# EAGLE design unitygain (EAGLE 7.7.0)
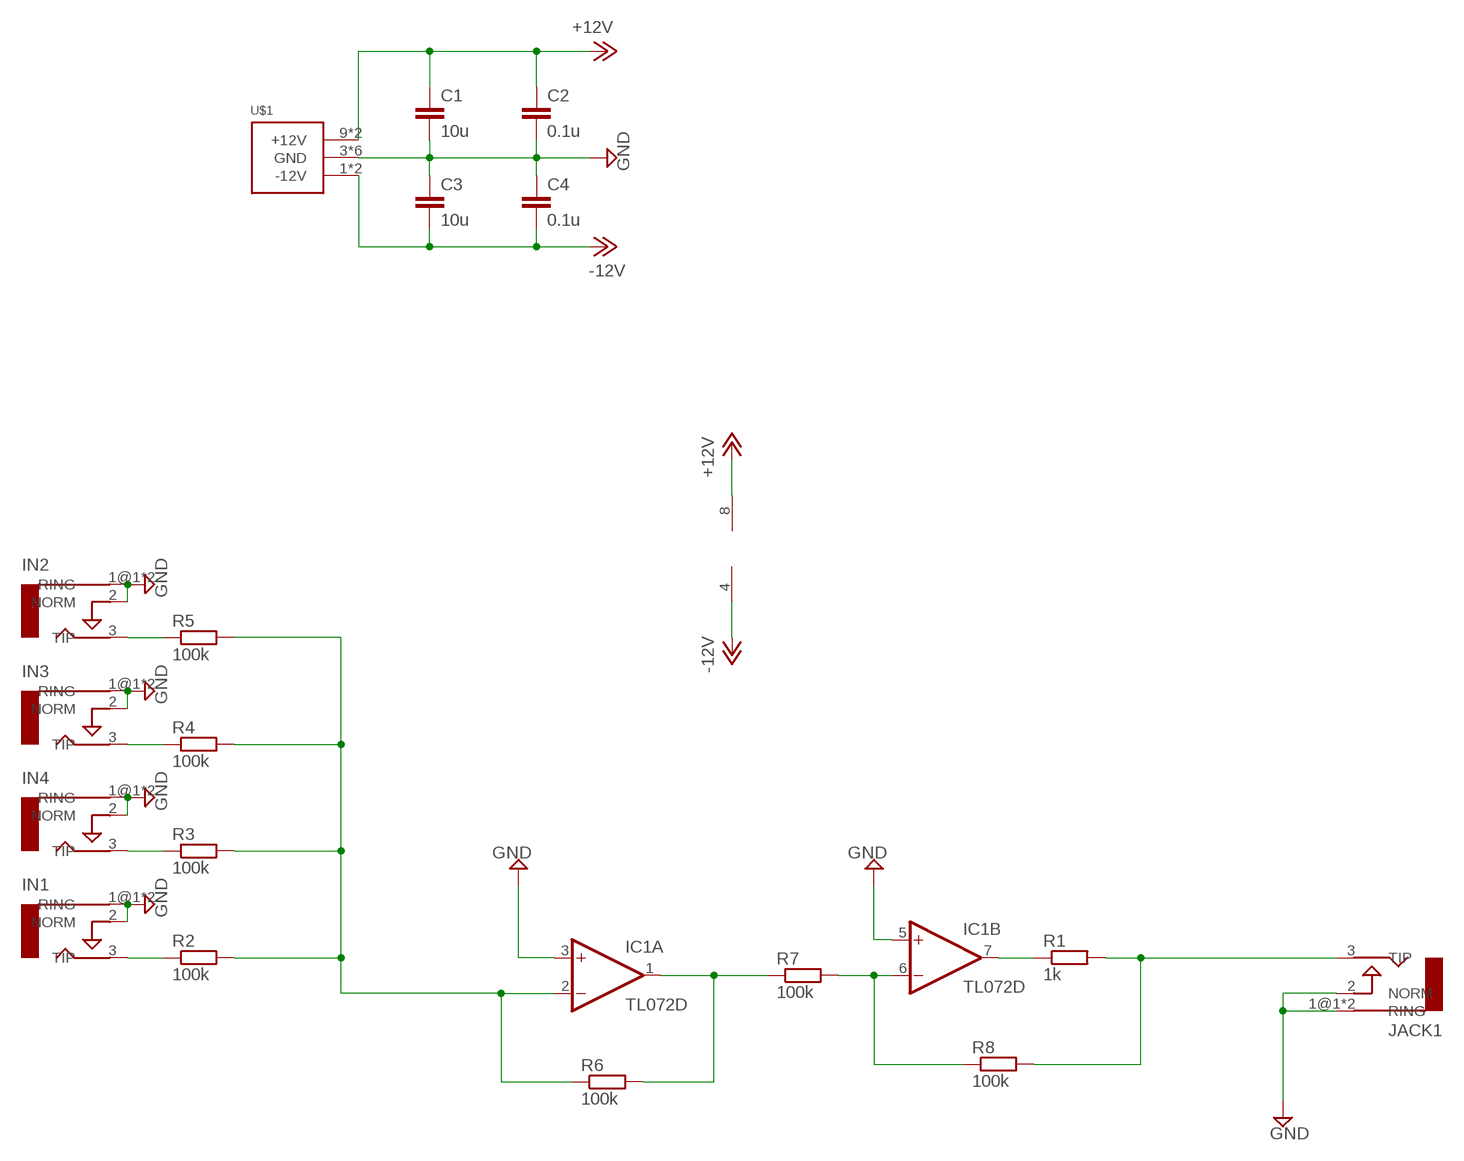
[diagram p0: schematic, sheet 1]

## Parts
C1  10u  C-EUC0805  [C0805]
C2  0.1u  C-EUC0805  [C0805]
C3  10u  C-EUC0805  [C0805]
C4  0.1u  C-EUC0805  [C0805]
IC1  TL072D  [SO08]
IN1  IN1  AUDIO-JACKERTHENVAR  [ERTHENVAR-JACK]
IN2  IN2  AUDIO-JACKERTHENVAR  [ERTHENVAR-JACK]
IN3  IN3  AUDIO-JACKERTHENVAR  [ERTHENVAR-JACK]
IN4  IN4  AUDIO-JACKERTHENVAR  [ERTHENVAR-JACK]
JACK1  OUT  AUDIO-JACKERTHENVAR  [ERTHENVAR-JACK]
R1  1k  R-EU_R0805  [R0805]
R2  100k  R-EU_R0805  [R0805]
R3  100k  R-EU_R0805  [R0805]
R4  100k  R-EU_R0805  [R0805]
R5  100k  R-EU_R0805  [R0805]
R6  100k  R-EU_R0805  [R0805]
R7  100k  R-EU_R0805  [R0805]
R8  100k  R-EU_R0805  [R0805]
U$1  POWER_SIMPLE10  [POWER_10]

## Nets
+12V: C1.1 C2.1 IC1.8(P:V+) U$1.9(+12V) U$1.10(+12V)
-12V: C3.2 C4.2 IC1.4(P:V-) U$1.1(-12V) U$1.2(-12V)
GND: C1.2 C2.2 C3.1 C4.1 IC1.3(A:+IN) IC1.5(B:+IN) IN1.1@1(RING) IN1.1@2(RING) IN1.2(NORM) IN2.1@1(RING) IN2.1@2(RING) IN2.2(NORM) IN3.1@1(RING) IN3.1@2(RING) IN3.2(NORM) IN4.1@1(RING) IN4.1@2(RING) IN4.2(NORM) JACK1.1@1(RING) JACK1.1@2(RING) JACK1.2(NORM) U$1.3(GND) U$1.4(GND) U$1.5(GND) U$1.6(GND) U$1.7(GND) U$1.8(GND)
N$1: JACK1.3(TIP) R1.2 R8.2
N$2: IC1.7(B:OUT) R1.1
N$3: IN1.3(TIP) R2.1
N$4: IC1.6(B:-IN) R7.2 R8.1
N$5: IC1.2(A:-IN) R2.2 R3.2 R4.2 R5.2 R6.1
N$7: IN4.3(TIP) R3.1
N$8: IN3.3(TIP) R4.1
N$9: IN2.3(TIP) R5.1
N$15: IC1.1(A:OUT) R6.2 R7.1

## Library data of the parts
C1-C4 = rcl:C-EU: CAPACITOR, European symbol
IC1 = linear:TL072: OP AMP
IN1-IN4 JACK1 = erthenvar:AUDIO-JACK: Switching Mono 3.5mm Audio Jack from Erthenvar.
R1-R8 = rcl:R-EU_: RESISTOR, European symbol
U$1 = eurorack:POWER_SIMPLE

## Board
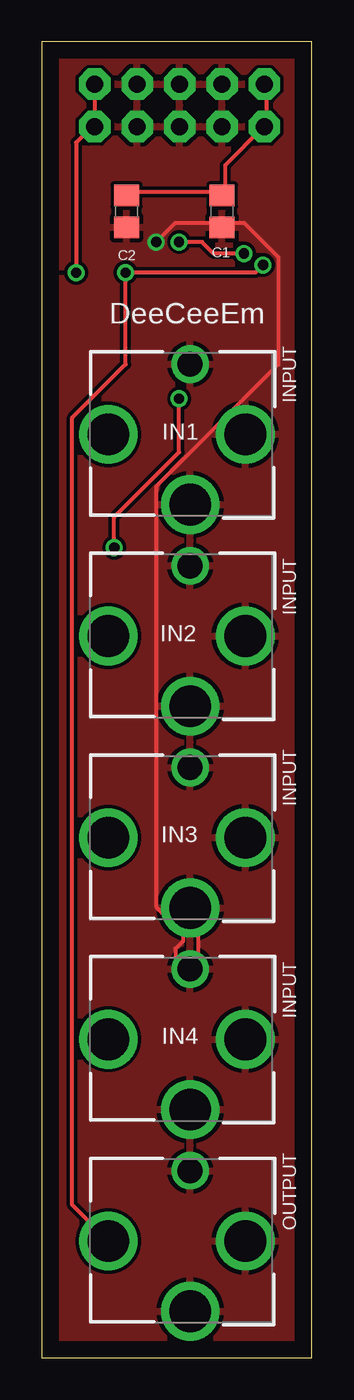
[diagram p1: board, top side]
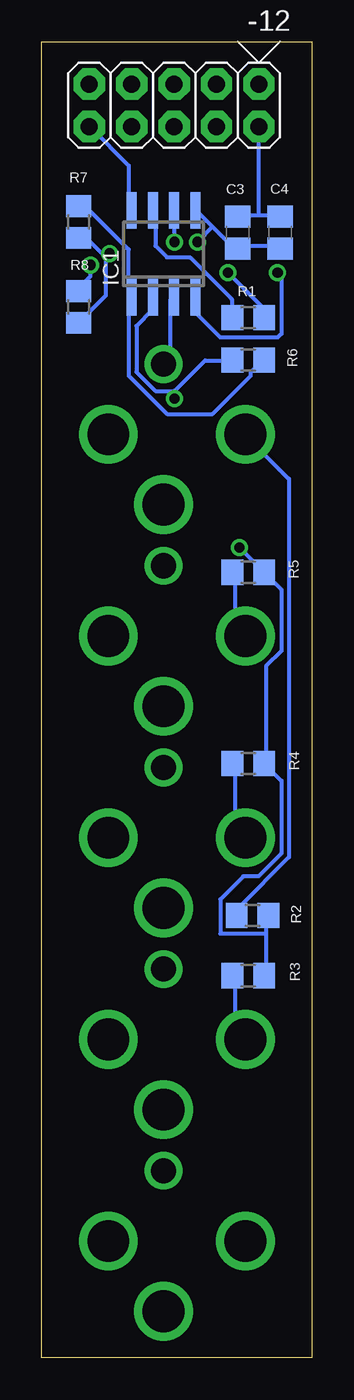
[diagram p2: board, bottom side, seen from below]

Size 16.18 x 78.73 mm. Coordinates in mm from the lower left corner, seen from the top.
Outline: 0,0 16.18,0 16.18,78.73 0,78.73 0,0
Copper layers (1*16): Top 0.035mm / dielectric 1.5mm / Bottom 0.035mm
Design rules "default": minimum track width 10mil, minimum drill 24mil, track to track 8mil, track to pad 8mil, pad to pad 8mil, via to via 8mil, smd to smd 8mil, copper to edge 40mil, drill to drill 8mil, minimum pad ring 10mil, minimum via ring 8mil, stop-mask expansion 4mil, vias tented up to drill 0mil, thermal gap 10mil

### Footprints (pad centres in the part's own frame; a part is rotated, then mirrored left to right if it is on the bottom)
C0805 = smd 1.3 x 1.5: 1 -0.95,0; 2 0.95,0
SO08 = smd 0.6 x 2.2: 1 -1.905,-2.6; 2 -0.635,-2.6; 3 0.635,-2.6; 4 1.905,-2.6; 5 1.905,2.6; 6 0.635,2.6; 7 -0.635,2.6; 8 -1.905,2.6
ERTHENVAR-JACK = drill 2.5: 1@1 -4.2,0; 2 0,-3.3; 3 0,4.9 | drill 1.5: 1@2 4.2,0
R0805 = smd 1.3 x 1.5: 1 -0.95,0; 2 0.95,0
POWER_10 = drill 1.016 pad 1.88 octagon: 1 -5.08,-1.27; 2 -5.08,1.27; 3 -2.54,-1.27; 4 -2.54,1.27; 5 0,-1.27; 6 0,1.27; 7 2.54,-1.27; 8 2.54,1.27; 9 5.08,-1.27; 10 5.08,1.27

### Placement (x,y rotation side)
C1  10.79,68.58 270 top
C2  5.08,68.58 270 top
C3  4.45,67.31 90 bottom
C4  1.91,67.31 90 bottom
IC1  8.89,66.04 0 bottom
IN1  8.89,55.24 90 top
IN2  8.89,43.18 90 top
IN3  8.89,31.11 90 top
IN4  8.89,19.05 90 top
JACK1  8.89,6.99 90 top
R1  3.81,62.23 0 bottom
R2  3.56,26.47 0 bottom
R3  3.81,22.86 0 bottom
R4  3.81,35.56 0 bottom
R5  3.81,46.99 0 bottom
R6  3.81,59.69 0 bottom
R7  13.97,67.94 270 bottom
R8  13.97,62.87 90 bottom
U$1  8.26,74.93 180 bottom

### Tracks (layer width: path | path; a pad name or v marks a point on that pad's centre or on a via)
+12V
  Top 0.254: C2.1 5.26,69.72 10.74,69.72 C1.1 10.97,69.72 10.97,71.32 13.26,73.61 U$1.10 13.49,73.84 13.49,76.12 U$1.9
  Bottom 0.254: IC1.8 10.97,68.81 10.97,71.32 13.26,73.61 U$1.10
-12V  (via drill 0.61)
  Top 0.254: v2.06,64.92 2.06,72.69 2.97,73.61 U$1.2 3.2,73.84 3.2,76.12 U$1.1
  Bottom 0.254: 3.2,68.35 4.34,68.35 C3.2 | 3.2,68.35 2.06,68.35 C4.2 | v2.06,64.92 1.83,64.69 1.83,61.27 2.06,61.04 5.49,61.04 6.86,62.41 6.86,63.32 IC1.4 | 3.2,68.35 3.2,73.61 U$1.2
GND  (via drill 0.61)
  Top 0.254: v6.86,66.75 8,67.89 12.12,67.89 14.17,65.84 14.17,59.44 6.86,52.12 6.86,26.98 8.46,25.38 8.46,24.92 8,24.46 8,23.32 8.23,23.09 8.46,23.32 8.46,23.55 8.23,23.55 8.23,23.32 8.69,22.86 8.91,22.86 9.14,23.09 9.37,23.09 9.37,26.29 9.6,26.52 9.14,26.98 9.14,27.2 8.91,27.43 8.46,27.43 8.23,27.2 8.46,26.98 8.46,26.52 8.23,26.52 8.23,26.98 8.46,27.2 8.91,27.2 8.91,26.98 IN3.1@1
  Bottom 0.254: IC1.3 8.46,63.32 8.46,59.89 8.69,59.66 IN1.1@2 | C4.1 2.06,66.52 4.34,66.52 C3.1 4.57,66.29 5.94,67.67 | 5.94,67.67 6.86,68.58 IC1.5 | 5.94,67.67 v6.86,66.75
  pour Top: 0,0 16.51,0 16.51,78.74 0,78.74
N$1  (via drill 0.61)
  Top 0.254: v13.26,65.38 12.8,64.92 v5.03,64.92 5.03,59.44 1.83,56.24 1.83,9.14 3.89,7.09 JACK1.3
  Bottom 0.254: v5.03,64.92 2.97,62.87 2.97,62.41 R1.2 | v13.26,65.38 13.26,64.69 13.95,64.01 R8.2
N$2
  Bottom 0.254: R1.1 4.8,62.41 4.8,63.32 7.32,65.84 8.69,65.84 9.37,66.52 9.37,68.58 IC1.7
N$3
  Bottom 0.254: R2.1 4.34,26.52 4.34,26.98 1.37,29.95 1.37,52.58 3.89,55.09 IN1.3
N$4  (via drill 0.61)
  Top 0.254: v8.23,66.75 9.6,66.75 10.29,66.06 v12.12,66.06
  Bottom 0.254: 12.34,65.84 12.34,63.55 13.95,61.95 R8.1 | 12.34,65.84 13.49,66.98 13.95,66.98 R7.2 | v8.23,66.75 8.23,68.58 IC1.6 | 12.34,65.84 v12.12,66.06
N$5  (via drill 0.61)
  Top 0.254: v8.23,57.38 8.23,54.18 4.34,50.29 v4.34,48.46
  Bottom 0.254: 8.23,57.84 6.4,59.66 4.8,59.66 R6.1 | 8.23,57.84 9.37,57.84 10.52,58.98 10.52,61.72 9.6,62.64 9.6,63.32 IC1.2 | 2.74,25.38 2.74,26.29 R2.2 | 2.74,25.38 2.74,22.86 R3.2 | 2.74,25.38 5.49,25.38 5.49,27.43 4.12,28.8 3.2,28.8 1.83,30.18 1.83,34.52 2.74,35.43 R4.2 2.74,35.66 2.74,41.38 1.83,42.29 1.83,45.95 2.74,46.86 R5.2 2.97,47.09 v4.34,48.46 | v8.23,57.38 8.23,57.84
N$7
  Bottom 0.254: R3.1 4.57,22.86 4.57,19.66 4.12,19.2 IN4.3
N$8
  Bottom 0.254: R4.1 4.57,35.43 4.57,31.77 4.12,31.32 IN3.3
N$9
  Bottom 0.254: R5.1 4.57,46.86 4.57,43.66 4.12,43.2 IN2.3
N$15
  Bottom 0.254: R6.2 2.97,59.66 3.66,58.98 3.66,58.75 5.94,56.46 8.69,56.46 10.97,58.75 10.97,63.32 IC1.1 10.97,63.55 10.97,66.29 13.49,68.81 13.95,68.81 R7.1

### Text on the board
tNames: DeeCeeEm | INPUT | INPUT | INPUT | INPUT | OUTPUT